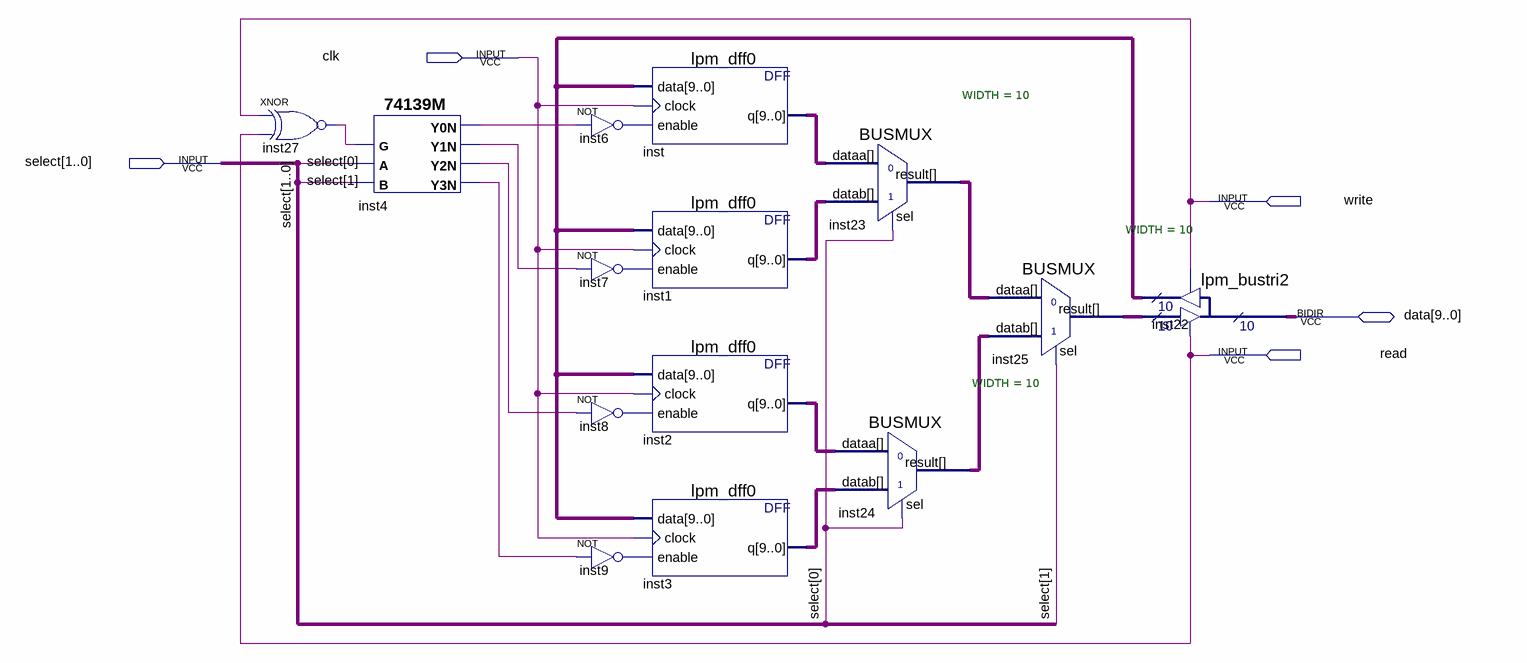
[diagram p0: schematic sheet]
// Quartus schematic gpr.bdf as structural Verilog: 14 symbols, 5 pins
module gpr (
  input  clk,
  input  [1:0] select,
  input  write,
  input  read,
  inout  [9:0] data
);

  wire inst4_y0n, inst4_y1n, inst4_y2n, inst4_y3n, inst6_out, inst7_out, inst8_out, inst9_out, inst27_out;
  wire [9:0] inst1_q, inst2_q, inst3_q, inst22_result, inst23_result, inst24_result, inst25_result, inst_q;

  xnor inst27 (inst27_out, write, read);
  \74139M  inst4 (
    .B(select[1]), .A(select[0]), .G(inst27_out), .Y3N(inst4_y3n), .Y2N(inst4_y2n), .Y0N(inst4_y0n),
    .Y1N(inst4_y1n));
  lpm_dff0 inst (.data(inst22_result), .clock(clk), .enable(inst6_out), .q(inst_q));
  not inst6 (inst6_out, inst4_y0n);
  lpm_dff0 inst1 (.data(inst22_result), .clock(clk), .enable(inst7_out), .q(inst1_q));
  not inst7 (inst7_out, inst4_y1n);
  lpm_dff0 inst2 (.data(inst22_result), .clock(clk), .enable(inst8_out), .q(inst2_q));
  not inst8 (inst8_out, inst4_y2n);
  lpm_dff0 inst3 (.data(inst22_result), .clock(clk), .enable(inst9_out), .q(inst3_q));
  not inst9 (inst9_out, inst4_y3n);
  BUSMUX #(.WIDTH(10)) inst23 (.datab(inst1_q), .sel(select[0]), .dataa(inst_q), .result(inst23_result));
  BUSMUX #(.WIDTH(10)) inst24 (.datab(inst3_q), .sel(select[0]), .dataa(inst2_q), .result(inst24_result));
  BUSMUX #(.WIDTH(10)) inst25 (.datab(inst24_result), .sel(select[1]), .dataa(inst23_result), .result(inst25_result));
  lpm_bustri2 inst22 (.enabledt(read), .data(inst25_result), .enabletr(write), .result(inst22_result), .tridata(data));
endmodule
